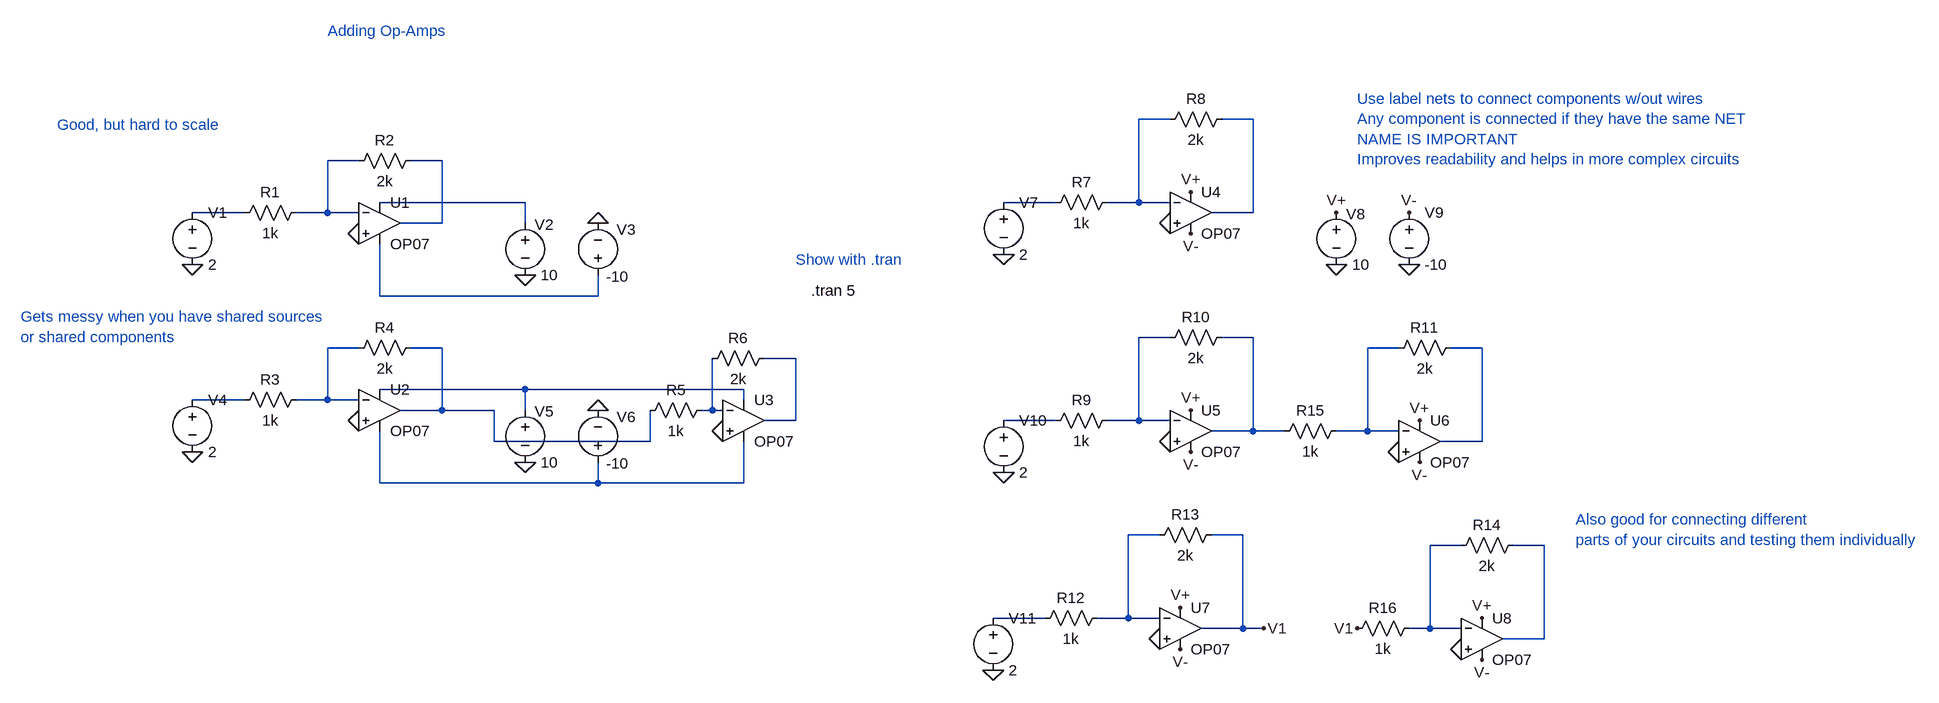
[diagram p0: schematic LTSPICE_Lesson5_OpAmps_Nets.asc]
LTSPICE_Lesson5_OpAmps_Nets.asc, the LTspice schematic file:
Version 4
SHEET 1 2656 968
WIRE 1440 64 1392 64
WIRE 1568 64 1520 64
WIRE 192 128 144 128
WIRE 320 128 272 128
WIRE 448 192 224 192
WIRE 1264 192 1184 192
WIRE 1392 192 1392 64
WIRE 1392 192 1344 192
WIRE 1440 192 1392 192
WIRE 16 208 -64 208
WIRE 144 208 144 128
WIRE 144 208 96 208
WIRE 192 208 144 208
WIRE 1568 208 1568 64
WIRE 1568 208 1504 208
WIRE 320 224 320 128
WIRE 320 224 256 224
WIRE 448 224 448 192
WIRE 224 336 224 256
WIRE 560 336 560 304
WIRE 560 336 224 336
WIRE 1440 400 1392 400
WIRE 1568 400 1520 400
WIRE 192 416 144 416
WIRE 320 416 272 416
WIRE 1792 416 1744 416
WIRE 1920 416 1872 416
WIRE 864 432 816 432
WIRE 448 480 224 480
WIRE 784 480 448 480
WIRE 16 496 -64 496
WIRE 144 496 144 416
WIRE 144 496 96 496
WIRE 192 496 144 496
WIRE 784 496 784 480
WIRE 320 512 320 416
WIRE 320 512 256 512
WIRE 400 512 320 512
WIRE 448 512 448 480
WIRE 736 512 736 432
WIRE 736 512 720 512
WIRE 752 512 736 512
WIRE 864 528 864 432
WIRE 864 528 816 528
WIRE 1264 528 1184 528
WIRE 1392 528 1392 400
WIRE 1392 528 1344 528
WIRE 1440 528 1392 528
WIRE 1568 544 1568 400
WIRE 1568 544 1504 544
WIRE 1616 544 1568 544
WIRE 1744 544 1744 416
WIRE 1744 544 1696 544
WIRE 1792 544 1744 544
WIRE 400 560 400 512
WIRE 640 560 640 512
WIRE 640 560 400 560
WIRE 1920 560 1920 416
WIRE 1920 560 1856 560
WIRE 224 624 224 544
WIRE 560 624 560 592
WIRE 560 624 224 624
WIRE 784 624 784 560
WIRE 784 624 560 624
WIRE 1424 704 1376 704
WIRE 1552 704 1504 704
WIRE 1888 720 1840 720
WIRE 2016 720 1968 720
WIRE 1248 832 1168 832
WIRE 1376 832 1376 704
WIRE 1376 832 1328 832
WIRE 1424 832 1376 832
WIRE 1552 848 1552 704
WIRE 1552 848 1488 848
WIRE 1584 848 1552 848
WIRE 1840 848 1840 720
WIRE 1840 848 1808 848
WIRE 1888 848 1840 848
WIRE 2016 864 2016 720
WIRE 2016 864 1952 864
FLAG 192 240 0
FLAG 448 304 0
FLAG 560 224 0
FLAG -64 288 0
FLAG 192 528 0
FLAG 448 592 0
FLAG 560 512 0
FLAG -64 576 0
FLAG 752 544 0
FLAG 1440 224 0
FLAG 1696 288 0
FLAG 1184 272 0
FLAG 1808 288 0
FLAG 1696 208 V+
FLAG 1472 176 V+
FLAG 1472 240 V-
FLAG 1808 208 V-
FLAG 1440 560 0
FLAG 1184 608 0
FLAG 1472 512 V+
FLAG 1472 576 V-
FLAG 1792 576 0
FLAG 1824 528 V+
FLAG 1824 592 V-
FLAG 1424 864 0
FLAG 1168 912 0
FLAG 1456 816 V+
FLAG 1456 880 V-
FLAG 1888 880 0
FLAG 1920 832 V+
FLAG 1920 896 V-
FLAG 1584 848 V1
FLAG 1728 848 V1
SYMBOL OpAmps\\OP07 224 160 R0
SYMATTR InstName U1
SYMBOL res 112 192 R90
WINDOW 0 0 56 VBottom 2
WINDOW 3 32 56 VTop 2
SYMATTR InstName R1
SYMATTR Value 1k
SYMBOL res 288 112 R90
WINDOW 0 0 56 VBottom 2
WINDOW 3 32 56 VTop 2
SYMATTR InstName R2
SYMATTR Value 2k
SYMBOL voltage -64 192 R0
WINDOW 123 0 0 Left 0
WINDOW 39 0 0 Left 0
SYMATTR InstName V1
SYMATTR Value 2
SYMBOL voltage 448 208 R0
WINDOW 0 15 18 Left 2
WINDOW 123 0 0 Left 0
WINDOW 39 0 0 Left 0
SYMATTR InstName V2
SYMATTR Value 10
SYMBOL voltage 560 320 R180
WINDOW 0 -58 86 Left 2
WINDOW 3 -48 14 Left 2
WINDOW 123 0 0 Left 0
WINDOW 39 0 0 Left 0
SYMATTR InstName V3
SYMATTR Value -10
SYMBOL OpAmps\\OP07 224 448 R0
SYMATTR InstName U2
SYMBOL res 112 480 R90
WINDOW 0 0 56 VBottom 2
WINDOW 3 32 56 VTop 2
SYMATTR InstName R3
SYMATTR Value 1k
SYMBOL res 288 400 R90
WINDOW 0 0 56 VBottom 2
WINDOW 3 32 56 VTop 2
SYMATTR InstName R4
SYMATTR Value 2k
SYMBOL voltage -64 480 R0
WINDOW 123 0 0 Left 0
WINDOW 39 0 0 Left 0
SYMATTR InstName V4
SYMATTR Value 2
SYMBOL voltage 448 496 R0
WINDOW 0 15 18 Left 2
WINDOW 123 0 0 Left 0
WINDOW 39 0 0 Left 0
SYMATTR InstName V5
SYMATTR Value 10
SYMBOL voltage 560 608 R180
WINDOW 0 -58 86 Left 2
WINDOW 3 -48 14 Left 2
WINDOW 123 0 0 Left 0
WINDOW 39 0 0 Left 0
SYMATTR InstName V6
SYMATTR Value -10
SYMBOL OpAmps\\OP07 784 464 R0
SYMATTR InstName U3
SYMBOL res 736 496 R90
WINDOW 0 0 56 VBottom 2
WINDOW 3 32 56 VTop 2
SYMATTR InstName R5
SYMATTR Value 1k
SYMBOL res 832 416 R90
WINDOW 0 0 56 VBottom 2
WINDOW 3 32 56 VTop 2
SYMATTR InstName R6
SYMATTR Value 2k
SYMBOL OpAmps\\OP07 1472 144 R0
SYMATTR InstName U4
SYMBOL res 1360 176 R90
WINDOW 0 0 56 VBottom 2
WINDOW 3 32 56 VTop 2
SYMATTR InstName R7
SYMATTR Value 1k
SYMBOL res 1536 48 R90
WINDOW 0 0 56 VBottom 2
WINDOW 3 32 56 VTop 2
SYMATTR InstName R8
SYMATTR Value 2k
SYMBOL voltage 1184 176 R0
WINDOW 123 0 0 Left 0
WINDOW 39 0 0 Left 0
SYMATTR InstName V7
SYMATTR Value 2
SYMBOL voltage 1696 192 R0
WINDOW 0 15 18 Left 2
WINDOW 123 0 0 Left 0
WINDOW 39 0 0 Left 0
SYMATTR InstName V8
SYMATTR Value 10
SYMBOL voltage 1808 192 R0
WINDOW 123 0 0 Left 0
WINDOW 39 0 0 Left 0
SYMATTR InstName V9
SYMATTR Value -10
SYMBOL OpAmps\\OP07 1472 480 R0
SYMATTR InstName U5
SYMBOL res 1360 512 R90
WINDOW 0 0 56 VBottom 2
WINDOW 3 32 56 VTop 2
SYMATTR InstName R9
SYMATTR Value 1k
SYMBOL res 1536 384 R90
WINDOW 0 0 56 VBottom 2
WINDOW 3 32 56 VTop 2
SYMATTR InstName R10
SYMATTR Value 2k
SYMBOL voltage 1184 512 R0
WINDOW 123 0 0 Left 0
WINDOW 39 0 0 Left 0
SYMATTR InstName V10
SYMATTR Value 2
SYMBOL OpAmps\\OP07 1824 496 R0
SYMATTR InstName U6
SYMBOL res 1888 400 R90
WINDOW 0 0 56 VBottom 2
WINDOW 3 32 56 VTop 2
SYMATTR InstName R11
SYMATTR Value 2k
SYMBOL OpAmps\\OP07 1456 784 R0
SYMATTR InstName U7
SYMBOL res 1344 816 R90
WINDOW 0 0 56 VBottom 2
WINDOW 3 32 56 VTop 2
SYMATTR InstName R12
SYMATTR Value 1k
SYMBOL res 1520 688 R90
WINDOW 0 0 56 VBottom 2
WINDOW 3 32 56 VTop 2
SYMATTR InstName R13
SYMATTR Value 2k
SYMBOL voltage 1168 816 R0
WINDOW 123 0 0 Left 0
WINDOW 39 0 0 Left 0
SYMATTR InstName V11
SYMATTR Value 2
SYMBOL OpAmps\\OP07 1920 800 R0
SYMATTR InstName U8
SYMBOL res 1984 704 R90
WINDOW 0 0 56 VBottom 2
WINDOW 3 32 56 VTop 2
SYMATTR InstName R14
SYMATTR Value 2k
SYMBOL res 1712 528 R90
WINDOW 0 0 56 VBottom 2
WINDOW 3 32 56 VTop 2
SYMATTR InstName R15
SYMATTR Value 1k
SYMBOL res 1824 832 R90
WINDOW 0 0 56 VBottom 2
WINDOW 3 32 56 VTop 2
SYMATTR InstName R16
SYMATTR Value 1k
TEXT 144 -72 Left 2 ;Adding Op-Amps
TEXT -272 72 Left 2 ;Good, but hard to scale
TEXT -328 368 Left 2 ;Gets messy when you have shared sources\nor shared components
TEXT 1728 32 Left 2 ;Use label nets to connect components w/out wires\nAny component is connected if they have the same NET\nNAME IS IMPORTANT\nImproves readability and helps in more complex circuits
TEXT 2064 680 Left 2 ;Also good for connecting different\nparts of your circuits and testing them individually
TEXT 888 328 Left 2 !.tran 5
TEXT 864 280 Left 2 ;Show with .tran

The netlist it stands for:
* LTSPICE_Lesson5_OpAmps_Nets.asc
XU1 0 N003 N005 N008 N004 LT1001  ; OP07, pins In+ In- V+ V- OUT
R1 N003 N007 1k
R2 N004 N003 2k
V1 N007 0 2
V2 N005 0 10
V3 N008 0 -10
XU2 0 N011 N016 N020 N012 LT1001  ; OP07, pins In+ In- V+ V- OUT
R3 N011 N017 1k
R4 N012 N011 2k
V4 N017 0 2
V5 N016 0 10
V6 N020 0 -10
XU3 0 N018 N016 N020 N015 LT1001  ; OP07, pins In+ In- V+ V- OUT
R5 N018 N012 1k
R6 N015 N018 2k
XU4 0 N001 V+ V- N002 LT1001  ; OP07, pins In+ In- V+ V- OUT
R7 N001 N006 1k
R8 N002 N001 2k
V7 N006 0 2
V8 V+ 0 10
V9 V- 0 -10
XU5 0 N009 V+ V- N010 LT1001  ; OP07, pins In+ In- V+ V- OUT
R9 N009 N019 1k
R10 N010 N009 2k
V10 N019 0 2
XU6 0 N013 V+ V- N014 LT1001  ; OP07, pins In+ In- V+ V- OUT
R11 N014 N013 2k
XU7 0 N021 V+ V- V1 LT1001  ; OP07, pins In+ In- V+ V- OUT
R12 N021 N024 1k
R13 V1 N021 2k
V11 N024 0 2
XU8 0 N022 V+ V- N023 LT1001  ; OP07, pins In+ In- V+ V- OUT
R14 N023 N022 2k
R15 N013 N010 1k
R16 N022 V1 1k
* Adding Op-Amps
* Good, but hard to scale
* Gets messy when you have shared sources
* or shared components
* Use label nets to connect components w/out wires
* Any component is connected if they have the same NET
* NAME IS IMPORTANT
* Improves readability and helps in more complex circuits
* Also good for connecting different
* parts of your circuits and testing them individually
.tran 5
* Show with .tran
.lib LTC.lib
.backanno
.end